# Altium schematic sheet Sheet1.SchDoc
size A4; SheetNumber: 1; SheetTotal: 1
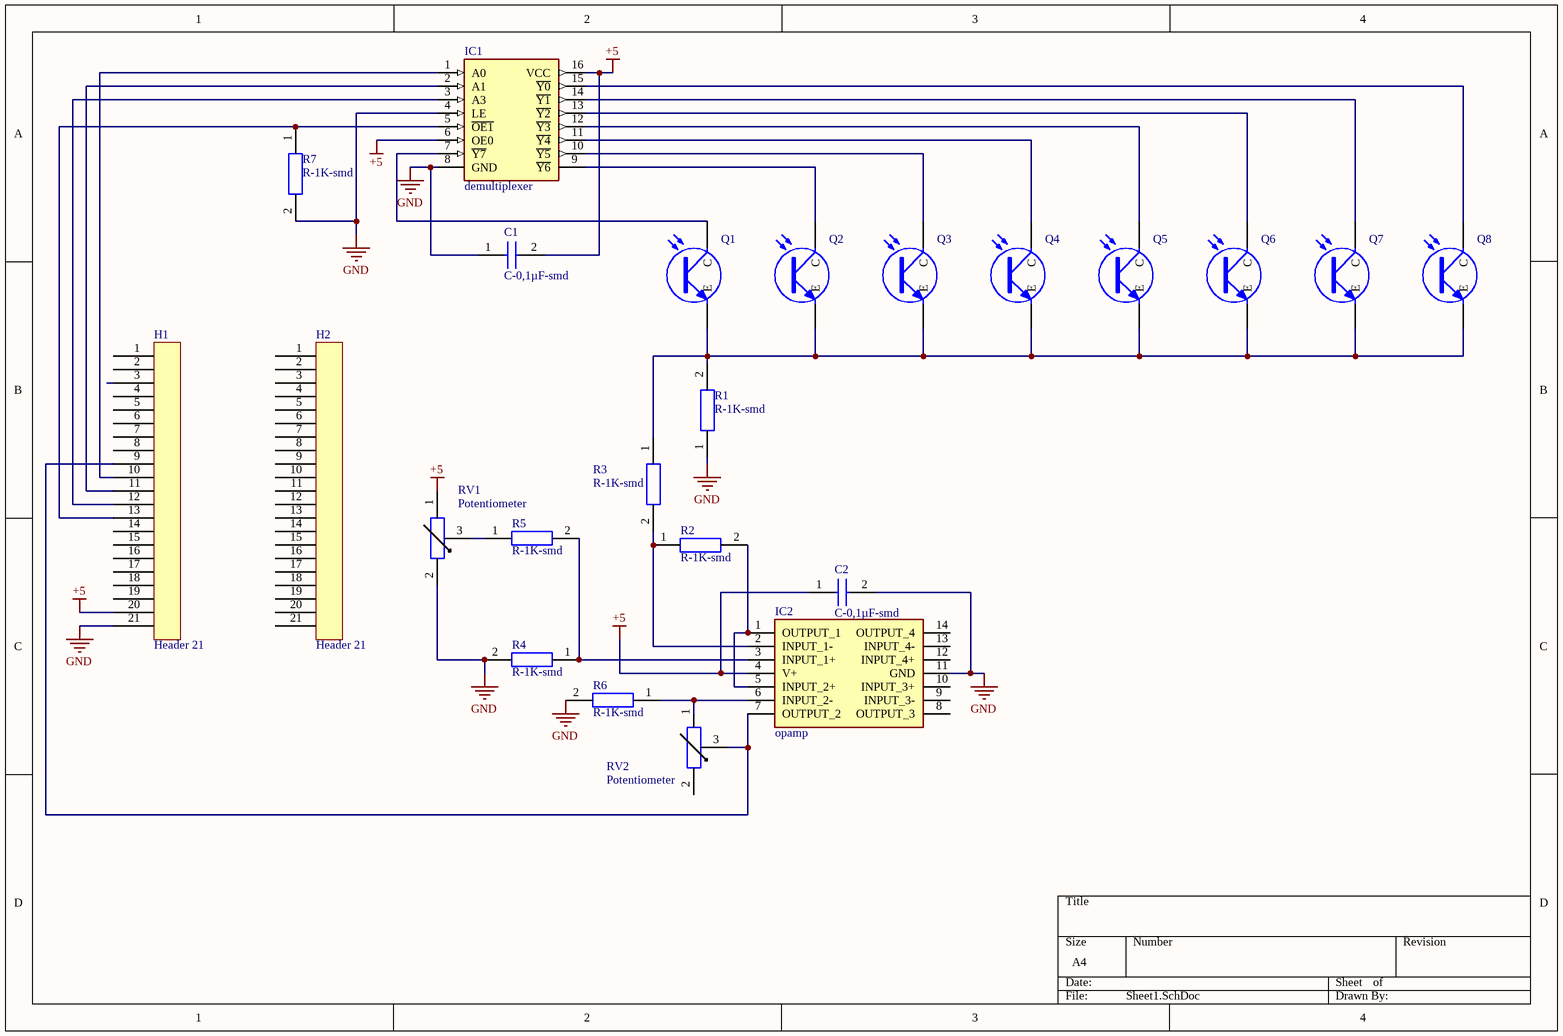
[diagram p0: Sheet1.SchDoc]

## Parts
C1  C-0,1µF-smd  [C-0,1µF-smd]
C2  C-0,1µF-smd  [C-0,1µF-smd]
H1  Header 21  [Header 21]
H2  Header 21  [Header 21]
IC1  demultiplexer  [demultiplexer]
IC2  opamp  [SOIC127P600X175-14N]
Q1  400-1100nm, 1mA, 130deg  [WL-STCW_0805]  (value not drawn)
Q2  400-1100nm, 1mA, 130deg  [WL-STCW_0805]  (value not drawn)
Q3  400-1100nm, 1mA, 130deg  [WL-STCW_0805]  (value not drawn)
Q4  400-1100nm, 1mA, 130deg  [WL-STCW_0805]  (value not drawn)
Q5  400-1100nm, 1mA, 130deg  [WL-STCW_0805]  (value not drawn)
Q6  400-1100nm, 1mA, 130deg  [WL-STCW_0805]  (value not drawn)
Q7  400-1100nm, 1mA, 130deg  [WL-STCW_0805]  (value not drawn)
Q8  400-1100nm, 1mA, 130deg  [WL-STCW_0805]  (value not drawn)
R1  R-1K-smd  [R-1K-smd]
R2  R-1K-smd  [R-1K-smd]
R3  R-1K-smd  [R-1K-smd]
R4  R-1K-smd  [R-1K-smd]
R5  R-1K-smd  [R-1K-smd]
R6  R-1K-smd  [R-1K-smd]
R7  R-1K-smd  [R-1K-smd]
RV1  Potentiometer  [Potentiometer]
RV2  Potentiometer  [Potentiometer]

## Nets
+5: C1.2 C2.1 H1.20 IC1.6(OE0) IC1.16(VCC) IC2.4(V+) RV1.1
GND: C1.1 C2.2 H1.21 IC1.4(LE) IC1.8(GND) IC2.11(GND) R1.1 R4.2 R6.2 R7.2 RV1.2
NetH1_9: H1.9 IC2.7(OUTPUT_2) RV2.3
NetH1_10: H1.10 IC1.1(A0)
NetH1_11: H1.11 IC1.2(A1)
NetH1_12: H1.12 IC1.3(A3)
NetH1_13: H1.13 IC1.5(~{OE1}) R7.1
NetIC1_7: IC1.7(~{Y7}) Q1.1(C)
NetIC1_9: IC1.9(~{Y6}) Q2.1(C)
NetIC1_10: IC1.10(~{Y5}) Q3.1(C)
NetIC1_11: IC1.11(~{Y4}) Q4.1(C)
NetIC1_12: IC1.12(~{Y3}) Q5.1(C)
NetIC1_13: IC1.13(~{Y2}) Q6.1(C)
NetIC1_14: IC1.14(~{Y1}) Q7.1(C)
NetIC1_15: IC1.15(~{Y0}) Q8.1(C)
NetIC2_1: IC2.1(OUTPUT_1) IC2.5(INPUT_2+) R2.2
NetIC2_2: IC2.2(INPUT_1-) R2.1 R3.2
NetIC2_3: IC2.3(INPUT_1+) R4.1 R5.2
NetIC2_6: IC2.6(INPUT_2-) R6.1 RV2.1
NetQ1_2: Q1.2(E) Q2.2(E) Q3.2(E) Q4.2(E) Q5.2(E) Q6.2(E) Q7.2(E) Q8.2(E) R1.2 R3.1
NetR5_1: R5.1 RV1.3

Not connected (* = marked no-connect by the designer): H1 1 2 3 4 5 6 7 8 14 15 16 17 18 19; H2 1 2 3 4 5 6 7 8 9 10 11 12 13 14 15 16 17 18 19 20 21; IC2 8(OUTPUT_3) 9(INPUT_3-) 10(INPUT_3+) 12(INPUT_4+) 13(INPUT_4-) 14(OUTPUT_4); RV2 2

## Library data of the parts
C1 C2 = C-0,1µF-smd: Capacitor; Manufacturer_Name: Kemet; Manufacturer_Part_Number: C0805C104K5RAC7411; Datasheet Link: https://componentsearchengine.com//C0805C104K5RAC7411.pdf; Height: 0.88mm; Mouser2 Part Number: 80-C0805C104K5RACLR; Mouser2 Price/Stock: https://www.mouser.com/Search/Refine.aspx?Keyword=80-C0805C104K5RACLR
IC1 = demultiplexer: Integrated Circuit; Manufacturer_Name: Texas Instruments; Manufacturer_Part_Number: CD74HC237M; Datasheet Link: http://www.ti.com/lit/ds/symlink/cd74hc237.pdf; Height: 1.75mm; Mouser2 Part Number: 595-CD74HC237M; Mouser2 Price/Stock: https://www.mouser.com/Search/Refine.aspx?Keyword=595-CD74HC237M
IC2 = opamp: Integrated Circuit; Manufacturer_Name: Texas Instruments; Manufacturer_Part_Number: LM2902MTX/NOPB; Datasheet Link: http://www.ti.com/lit/gpn/lm2902-n; Height: 1.2mm; Mouser2 Part Number: 926-LM2902MTX/NOPB; Mouser2 Price/Stock: https://www.mouser.com/Search/Refine.aspx?Keyword=926-LM2902MTX%2FNOPB
Q1-Q8 = 1540801NBA300: WL-STCW SMT Phototransistor Chip Waterclear, size 0805, 400-1100nm, 1mA, 130deg; Collector-Emitter Dark Current max.: 100nA; Chip Technology: Si; Range of Spectral Bandwidth max.: 1100nm; Range of Spectral Bandwidth min.: 400nm; Wavelength of Peak Sensitivity typ.: 940nm; Collector Current min.: 0.1mA; ComponentLink1Description: Manufacturer; ComponentLink1URL: http://www.we-online.de; ComponentLink2Description: Datasheet; ComponentLink2URL: https://www.we-online.com/catalog/datasheet/1540801NBA300.pdf; Packaging: Tape and Reel; Published Date: March 2020; Publisher: Wurth Elektronik; Size: 0805; Mounting Technology: SMT; Manufacturer Part Number: 1540801NBA300; Operating Temperature: -40 to +85degC; Viewing Angle: 130deg; Collector Current typ.: 1mA
R1-R7 = R-1K-smd: Resistor; Manufacturer_Name: YAGEO (PHYCOMP); Manufacturer_Part_Number: RC0805FR-131KL; Datasheet Link: https://datasheet.datasheetarchive.com/originals/distributors/Datasheets_SAMA/902f9e387b938f871d31120f5fc1d65e.pdf; Height: 0.6mm
RV1 RV2 = Potentiometer: PT10LH01-104A2020-S